# Altium schematic sheet CM4.SchDoc
size A4
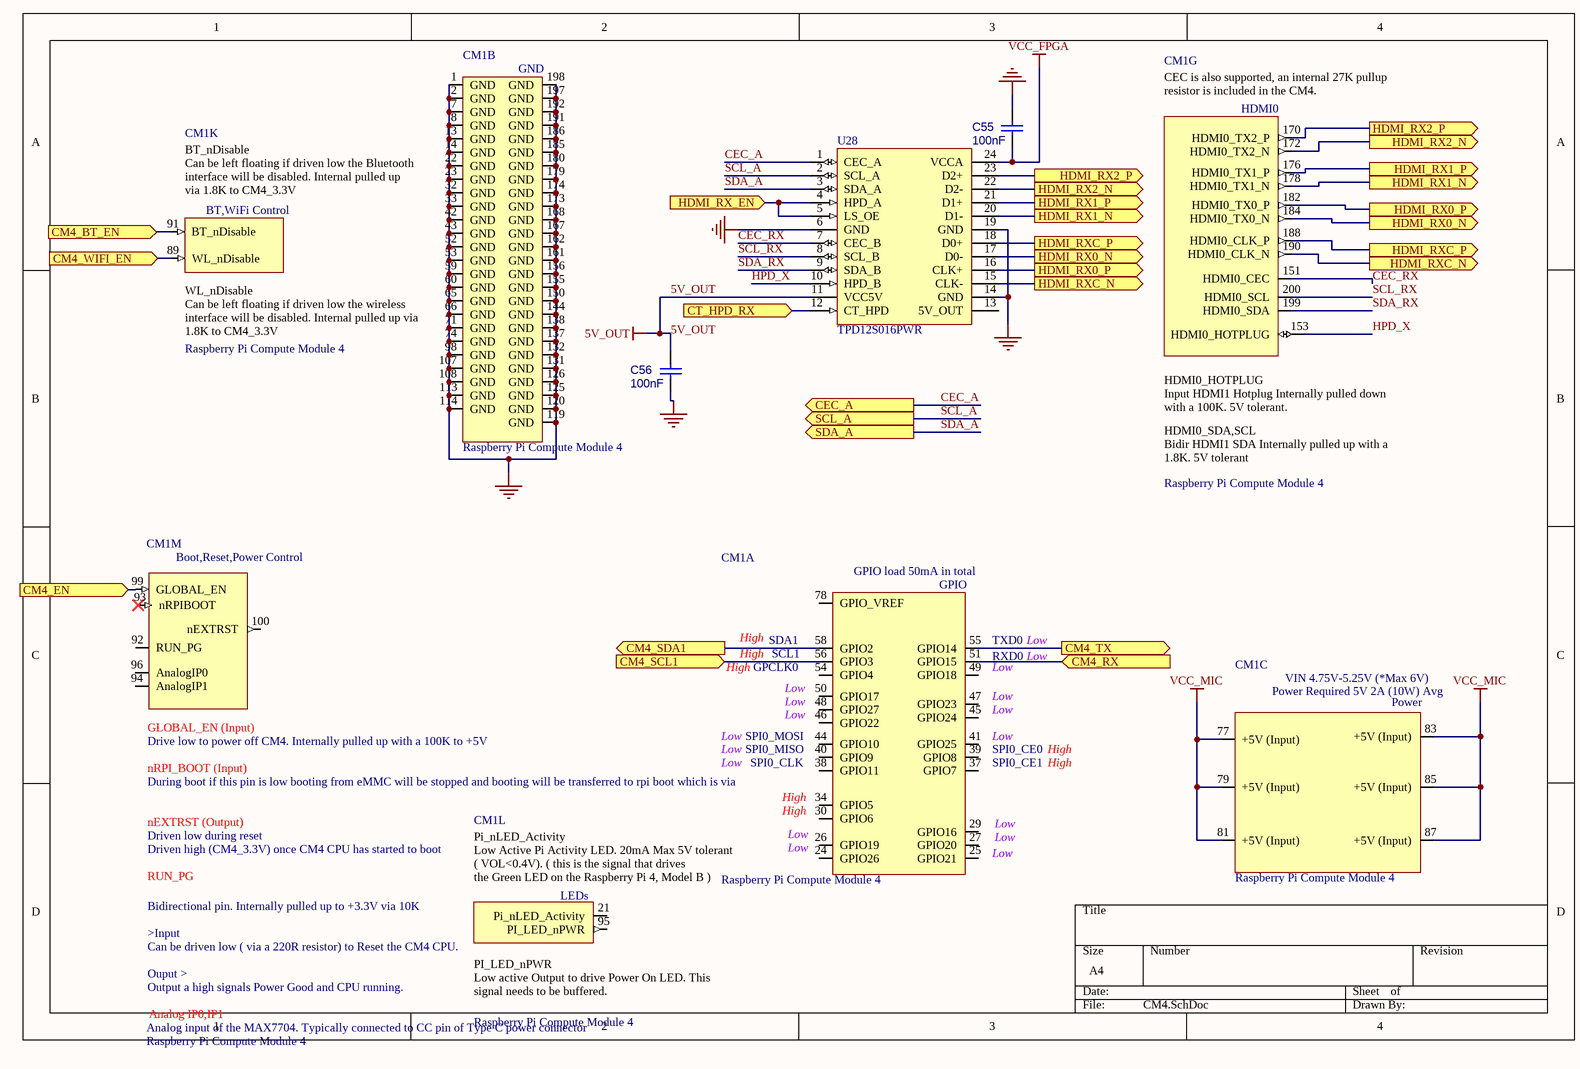
[diagram p0: CM4.SchDoc]

## Parts
C55  100nF  [0603_CAP UF HD]
C56  100nF  [0603_CAP UF HD]
CM1  Raspberry Pi Compute Module 4  [CM4-F40C-100DS-0.4v_1.5mm_0mm]  (parts A,B,C,G,K,L,M of 21)
U28  TPD12S016PWR  [SOP65P640X120-24N]

## Ports
CEC_A (out), CM4_BT_EN (in), CM4_EN (in), CM4_RX (in), CM4_SCL1 (in), CM4_SDA1 (out), CM4_TX (out), CM4_WIFI_EN (in), CT_HPD_RX (in), HDMI_RX0_N (out), HDMI_RX0_P (out), HDMI_RX1_N (out), HDMI_RX1_P (out), HDMI_RX2_N (out), HDMI_RX2_P (out), HDMI_RX_EN (in), HDMI_RXC_N (out), HDMI_RXC_P (out), SCL_A (out), SDA_A (out)

## Nets
5V_OUT: C56.1 U28.11(VCC5V)
GND: C55.1 C56.2 CM1.1(GND) CM1.2(GND) CM1.7(GND) CM1.8(GND) CM1.13(GND) CM1.14(GND) CM1.22(GND) CM1.23(GND) CM1.32(GND) CM1.33(GND) CM1.42(GND) CM1.43(GND) CM1.52(GND) CM1.53(GND) CM1.59(GND) CM1.60(GND) CM1.65(GND) CM1.66(GND) CM1.71(GND) CM1.74(GND) CM1.98(GND) CM1.107(GND) CM1.108(GND) CM1.113(GND) CM1.114(GND) CM1.119(GND) CM1.120(GND) CM1.125(GND) CM1.126(GND) CM1.131(GND) CM1.132(GND) CM1.137(GND) CM1.138(GND) CM1.144(GND) CM1.150(GND) CM1.155(GND) CM1.156(GND) CM1.161(GND) CM1.162(GND) CM1.167(GND) CM1.168(GND) CM1.173(GND) CM1.174(GND) CM1.179(GND) CM1.180(GND) CM1.185(GND) CM1.186(GND) CM1.191(GND) CM1.192(GND) CM1.197(GND) CM1.198(GND) U28.6(GND) U28.14(GND) U28.19(GND)
VCC_FPGA: C55.2 U28.24(VCCA)
VCC_MIC: CM1.77(+5V_(Input)) CM1.79(+5V_(Input)) CM1.81(+5V_(Input)) CM1.83(+5V_(Input)) CM1.85(+5V_(Input)) CM1.87(+5V_(Input))
CEC_A: U28.1(CEC_A) ; port CEC_A
CEC_RX: CM1.151(HDMI0_CEC) U28.7(CEC_B)
CM4_BT_EN: CM1.91(BT_nDisable) ; port CM4_BT_EN
CM4_EN: CM1.99(GLOBAL_EN) ; port CM4_EN
CM4_RX: CM1.51(GPIO15) ; port CM4_RX
CM4_SCL1: CM1.56(GPIO3) ; port CM4_SCL1
CM4_SDA1: CM1.58(GPIO2) ; port CM4_SDA1
CM4_TX: CM1.55(GPIO14) ; port CM4_TX
CM4_WIFI_EN: CM1.89(WL_nDisable) ; port CM4_WIFI_EN
CT_HPD_RX: U28.12(CT_HPD) ; port CT_HPD_RX
HDMI_RX0_N: CM1.184(HDMI0_TX0_N) U28.17(D0-) ; port HDMI_RX0_N
HDMI_RX0_P: CM1.182(HDMI0_TX0_P) U28.16(CLK+) ; port HDMI_RX0_P
HDMI_RX1_N: CM1.178(HDMI0_TX1_N) U28.20(D1-) ; port HDMI_RX1_N
HDMI_RX1_P: CM1.176(HDMI0_TX1_P) U28.21(D1+) ; port HDMI_RX1_P
HDMI_RX2_N: CM1.172(HDMI0_TX2_N) U28.22(D2-) ; port HDMI_RX2_N
HDMI_RX2_P: CM1.170(HDMI0_TX2_P) U28.23(D2+) ; port HDMI_RX2_P
HDMI_RX_EN: U28.4(HPD_A) U28.5(LS_OE) ; port HDMI_RX_EN
HDMI_RXC_N: CM1.190(HDMI0_CLK_N) U28.15(CLK-) ; port HDMI_RXC_N
HDMI_RXC_P: CM1.188(HDMI0_CLK_P) U28.18(D0+) ; port HDMI_RXC_P
HPD_X: CM1.153(HDMI0_HOTPLUG) U28.10(HPD_B)
SCL_A: U28.2(SCL_A) ; port SCL_A
SCL_RX: CM1.200(HDMI0_SCL) U28.8(SCL_B)
SDA_A: U28.3(SDA_A) ; port SDA_A
SDA_RX: CM1.199(HDMI0_SDA) U28.9(SDA_B)

Not connected (* = marked no-connect by the designer): CM1 21(Pi_nLED_Activity) 24(GPIO26) 25(GPIO21) 26(GPIO19) 27(GPIO20) 29(GPIO16) 30(GPIO6) 34(GPIO5) 37(GPIO7) 38(GPIO11) 39(GPIO8) 40(GPIO9) 41(GPIO25) 44(GPIO10) 45(GPIO24) 46(GPIO22) 47(GPIO23) 48(GPIO27) 49(GPIO18) 50(GPIO17) 54(GPIO4) 78(GPIO_VREF) 92(RUN_PG) 93(nRPIBOOT)* 94(AnalogIP1) 95(PI_LED_nPWR) 96(AnalogIP0) 100(nEXTRST); U28 13(5V_OUT)

## Notes on the sheet
- (in symbol CM4, part A) GPIO load 50mA in total; GPIO; High; SDA1; TXD0; Low; SCL1; RXD0; GPCLK0; SPI0_MOSI; SPI0_MISO; SPI0_CE0; SPI0_CLK; SPI0_CE1; by Amornthep Phunsin
- (in symbol CM4, part C) VIN 4.75V-5.25V (*Max 6V); Power Required 5V 2A (10W) Avg; Power; by Amornthep Phunsin
- (in symbol CM4, part G) HDMI0; CEC is also supported, an internal 27K pullup resistor is included in the CM4.; HDMI0_HOTPLUG / Input HDMI1 Hotplug Internally pulled down with a 100K. 5V tolerant.; HDMI0_SDA,SCL / Bidir HDMI1 SDA Internally pulled up with a 1.8K. 5V tolerant
- (in symbol CM4, part K) BT_nDisable / Can be left floating if driven low the Bluetooth interface will be disabled. Internal pulled up / via 1.8K to CM4_3.3V; BT,WiFi Control; WL_nDisable / Can be left floating if driven low the wireless interface will be disabled. Internal pulled up via / 1.8K to CM4_3.3V
- (in symbol CM4, part L) Pi_nLED_Activity / Low Active Pi Activity LED. 20mA Max 5V tolerant ( VOL<0.4V). ( this is the signal that drives / the Green LED on the Raspberry Pi 4, Model B ); LEDs; PI_LED_nPWR / Low active Output to drive Power On LED. This signal needs to be buffered.
- (in symbol CM4, part M) Boot,Reset,Power Control; GLOBAL_EN (Input); Drive low to power off CM4. Internally pulled up with a 100K to +5V; nRPI_BOOT (Input); During boot if this pin is low booting from eMMC will be stopped and booting will be transferred to rpi boot which is via; nEXTRST (Output); Driven low during reset; Driven high (CM4_3.3V) once CM4 CPU has started to boot; Bidirectional pin. Internally pulled up to +3.3V via 10K / >Input / Can be driven low ( via a 220R resistor) to Reset the CM4 CPU. / Ouput > / Output a high signals Power Good and CPU running.; Analog IP0,IP1; Analog input of the MAX7704. Typically connected to CC pin of Type C power connector

## Library data of the parts
C55 C56 = Cap: Capacitor; Value: 100nF
CM1 = CM4: Raspberry Pi Compute Module 4 by Amornthep Phunsin
U28 = TPD12S016PWR: AN: 25112; Trenz-Stock: Yes; Mixed: SMT; Extra: HDMI Companion Chip with I2C Level Shifting Buffer, 12 Channel ESD; Case: TSSOP24; HelpURL: B:\AD\adlib\datasheet\TPD12S016; H-ART: TPD12S016PWR